# Altium schematic sheet ECEN403_Team_49_Schematic.SchDoc
size A; SheetNumber: 1; SheetTotal: 1; SPICEModelCacheSBMTSTMV: <root> / <DocumentId>SBMTSTMV</DocumentId> / </root>
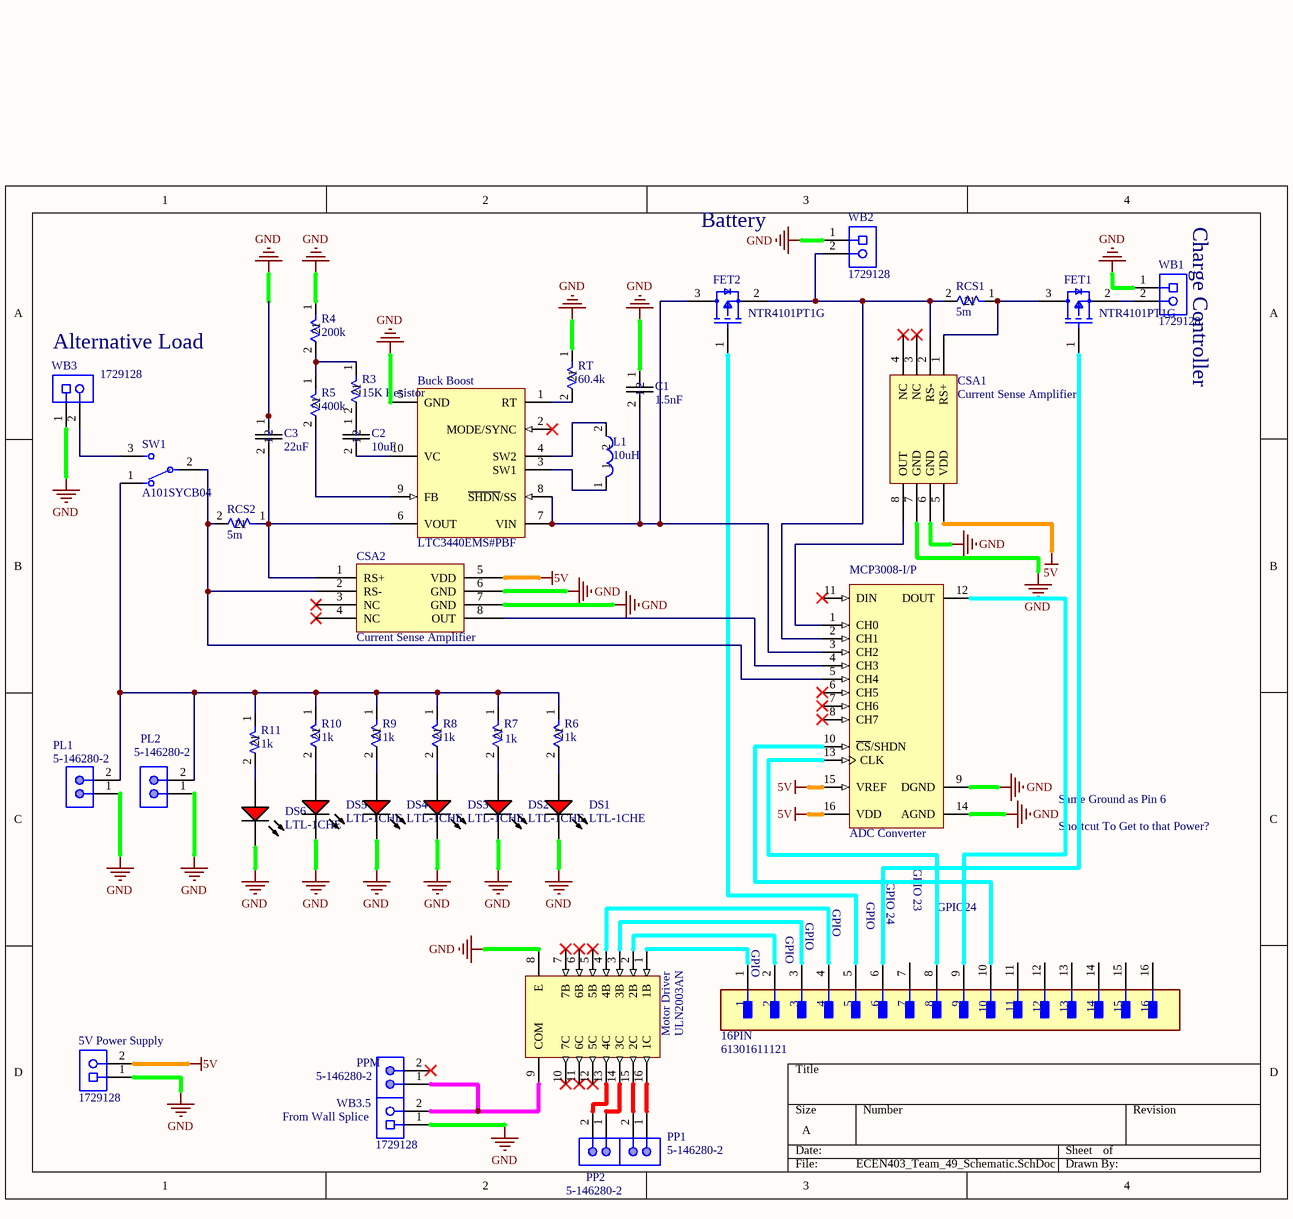
[diagram p0: ECEN403_Team_49_Schematic.SchDoc]

## Parts
5V_Power_Supply  1729128  [Wire To Board]
16PIN  61301611121  [16-FP-61301611121-MFG]
ADC_Converter  MCP3008-I/P  [PDIP300-P16]
Buck_Boost  LTC3440EMS#PBF  [LT-MS-10_M]
C1  1.5nF  [1.5nF Capacitor]
C2  10uF  [10uF Capacitor]
C3  22uF  [22uF Capacitor]
CSA1  Current Sense Amplifier  [Current Sense Amplifier]
CSA2  Current Sense Amplifier  [Current Sense Amplifier]
DS1  LTL-1CHE  [INDPR60-254-520X380X650]
DS2  LTL-1CHE  [INDPR60-254-520X380X650]
DS3  LTL-1CHE  [INDPR60-254-520X380X650]
DS4  LTL-1CHE  [INDPR60-254-520X380X650]
DS5  LTL-1CHE  [INDPR60-254-520X380X650]
DS6  LTL-1CHE  [INDPR60-254-520X380X650]
FET1  NTR4101PT1G  [FP-318-08-MFG]
FET2  NTR4101PT1G  [FP-318-08-MFG]
L1  10uH  [10uH Inductor]
Motor_Driver  ULN2003AN  [N0016A]
PL1  5-146280-2  [TECO-5-146280-2_V]
PL2  5-146280-2  [TECO-5-146280-2_V]
PP1  5-146280-2  [TECO-5-146280-2_V]
PP2  5-146280-2  [TECO-5-146280-2_V]
PPM  5-146280-2  [TECO-5-146280-2_V]
R3  15K Resistor  [15k Resistor]
R4  200k  [200K - duplicate]
R5  400k  [400K Resistor]
R6  1k  [PCBComponent_1]
R7  1k  [PCBComponent_1]
R8  1k  [PCBComponent_1]
R9  1k  [PCBComponent_1]
R10  1k  [PCBComponent_1]
R11  1k  [PCBComponent_1]
RCS1  5m  [Current Sense]
RCS2  5m  [Current Sense]
RT  60.4k  [PCBComponent_1]
SW1  A101SYCB04  [FP-A101SYCB04-MFG]
WB1  1729128  [Wire To Board]
WB2  1729128  [Wire To Board]
WB3  1729128  [Wire To Board]
WB3.5  1729128  [Wire To Board]

## Nets
5V: 5V_Power_Supply.2 ADC_Converter.15(VREF) ADC_Converter.16(VDD) CSA1.5(VDD) CSA2.5(VDD)
GND: 5V_Power_Supply.1 ADC_Converter.9(DGND) ADC_Converter.14(AGND) Buck_Boost.5(GND) C1.1 C3.1 CSA1.6(GND) CSA1.7(GND) CSA2.6(GND) CSA2.7(GND) DS1.2(K) DS2.2(K) DS3.2(K) DS4.2(K) DS5.2(K) DS6.2(K) Motor_Driver.8(E) PL1.1 PL2.1 R4.1 RT.1 WB1.1 WB2.1 WB3.1 WB3.5.1
Net16PIN_1: 16PIN.1 Motor_Driver.1(1B)
Net16PIN_2: 16PIN.2 Motor_Driver.2(2B)
Net16PIN_3: 16PIN.3 Motor_Driver.3(3B)
Net16PIN_4: 16PIN.4 Motor_Driver.4(4B)
Net16PIN_5: 16PIN.5 FET2.1(Gate)
Net16PIN_6: 16PIN.6 FET1.1(Gate)
Net16PIN_8: 16PIN.8 ADC_Converter.13(CLK)
Net16PIN_9: 16PIN.9 ADC_Converter.12(DOUT)
Net16PIN_10: 16PIN.10 ADC_Converter.10(~{CS}/SHDN)
NetADC_Converter_1: ADC_Converter.1(CH0) CSA1.8(OUT)
NetADC_Converter_2: ADC_Converter.2(CH1) CSA1.2(RS-) FET2.2(Source) RCS1.2 WB2.2
NetADC_Converter_3: ADC_Converter.3(CH2) Buck_Boost.7(VIN) Buck_Boost.8(~{SHDN}/SS) C1.2 FET2.3(Drain)
NetADC_Converter_4: ADC_Converter.4(CH3) CSA2.8(OUT)
NetADC_Converter_5: ADC_Converter.5(CH4) CSA2.2(RS-) RCS2.2 SW1.2
NetBuck_Boost_1: Buck_Boost.1(RT) RT.2
NetBuck_Boost_3: Buck_Boost.3(SW1) L1.1
NetBuck_Boost_4: Buck_Boost.4(SW2) L1.2
NetBuck_Boost_6: Buck_Boost.6(VOUT) C3.2 CSA2.1(RS+) RCS2.1
NetBuck_Boost_9: Buck_Boost.9(FB) R5.2
NetBuck_Boost_10: Buck_Boost.10(VC) C2.2
NetC2_1: C2.1 R3.2
NetCSA1_1: CSA1.1(RS+) FET1.3(Drain) RCS1.1
NetDS1_1: DS1.1(A) R6.2
NetDS2_1: DS2.1(A) R7.2
NetDS3_1: DS3.1(A) R8.2
NetDS4_1: DS4.1(A) R9.2
NetDS5_1: DS5.1(A) R10.2
NetDS6_1: DS6.1(A) R11.2
NetFET1_2: FET1.2(Source) WB1.2
NetMotor_Driver_9: Motor_Driver.9(COM) PPM.1 WB3.5.2
NetMotor_Driver_13: Motor_Driver.13(4C) PP2.2
NetMotor_Driver_14: Motor_Driver.14(3C) PP2.1
NetMotor_Driver_15: Motor_Driver.15(2C) PP1.2
NetMotor_Driver_16: Motor_Driver.16(1C) PP1.1
NetPL1_2: PL1.2 PL2.2 R6.1 R7.1 R8.1 R9.1 R10.1 R11.1 SW1.1
NetR3_1: R3.1 R4.2 R5.1
NetSW1_3: SW1.3 WB3.2

Not connected (* = marked no-connect by the designer): 16PIN 7 11 12 13 14 15 16; ADC_Converter 6(CH5)* 7(CH6)* 8(CH7)* 11(DIN)*; Buck_Boost 2(MODE/SYNC)*; CSA1 3(NC)* 4(NC)*; CSA2 3(NC)* 4(NC)*; Motor_Driver 5(5B)* 6(6B)* 7(7B)* 10(7C)* 11(6C)* 12(5C)*; PPM 2*

## Notes on the sheet
- Battery
- (near WB1) Charge Controller
- (near WB3) Alternative Load
- Same Ground as Pin 6
- GPIO 24
- GPIO 23
- Shortcut To Get to that Power?
- (near 16PIN) GPIO
- GPIO
- GPIO24
- From Wall Splice

## Library data of the parts
5V_Power_Supply WB1-WB3 WB3.5 = CMP-2000-05815-1: PCB Terminal Block, 13.5 A, 400 V, 2-Pin THD, RoHS, Bulk; Manufacturer: Phoenix Contact; Package Version: 03/2015; No. of Rows: 1; Pitch: 5.08mm; No. of Positions: 2; Voltage Rating: 400V; Current Rating: 13500mA; Manufacturer URL: http://www.phoenixcontact.com/; Datasheet URL: https://datasheet.ciiva.com/16046/1729128-16046181.pdf; RoHS: TRUE; Package URL: https://www.phoenixcontact.com/online/portal/pi/pxc/product_detail_page/!ut/p/b1/3VdJjqNKFDxLH8AFycySyWY2ozFsEPOMMQaDOX1XedGL_1Vdm5YXJleknhSKeBkvI6EA8ncAo3AYoDhBQGco6KN7VURTdemj9us_IEKEZo_YHiPAEWEFmDGOHMORkqKYCORBZxgL7ZoaZYcbFFUZ3fqxSY6GOuxydWUuHqz1ynmMFygu583Bob0Ewr6Sd_l-5m-kAueHiB0jpRwZwe58wwtkpxtMYd_LmGcDRU02dRNEyWt6Y2ti5pSyJ_reIkzIulrqApdnbT11V5jnCKbYNCvhEM1MCpPByat_X379-iThf08CI5GfOPqfBeS3BRoBOdD55AKVv0iLwCMq-2BrzXWSGRH7pUGD9uwXQjiph3xL0DKQwdGa0JImiIOmBNOestqgwTHSSs2oOep-78apyXQBvNi8ZLaFjvjWvcaUEBu0MC6Wbe-d6mB0FAebo2lUWinqYaZs5DAYzV0RP9yitUjnGJ0iI9xhZkT42OCQNUJJhkgWINNQLP2JFP6OpMg3JCVg70jqHT0lvKOnhHf0lPuOnnLf0VPuWx6_dxwUIvwk5WMkT0kLL1mh61l2yZVSzG3pYV_bqo-mj6uMKwKwdnnW8Jh5RTOJzMOA5c-eJDaZQw4mTMPH02PvS_ZAqNVjVTo2WyYLkwH_KU1mmmG5kjRhDqPXLwwVHvVOjCM60-fpXvTDfMGW1PVFVS1r4e4yVDk4ZdNbkUHvqPqQSeian4UD39fNKmachqdJ1NJbyk8rXT9mXTvPk3oE5meulKGgiruPJek-4I9hTT6G8ZLOyRSm2RRVbThERQad5OS28hdt4YW4vG0stgYYzsWsK4_7y6DZMjJSCqri1kyiZR5vD7pwIrNR7QwPHTcLTI5qT7eRlpHrdGiupYlqQDJ7zy_CND8fWWBoLRXxk1RVcXiBQwbTD4Xi7KL-FuO94t9xaqweXzH; PartNumber: 1729128; Package Description: 2-Pin Through Hole Device, Body 8.1 x 10.16 mm, Pitch 5.08 mm; Datasheet Version: 12/2013; Mounting Technology: ThroughHole; Orientation: Horizontal; Package Reference: 1729128-2; Packing: Bulk
16PIN = CMP-1502-01095-2: CONN HEADER VERT 16POS 2.54MM; Pitch: 0.1inch; Voltage Rating: 250V; Number of Contacts: 16; Gender: Male; Flammability Rating: UL94 V-0; Fastening Type: Pull; Contact Plating: Gold; Termination: Solder; Contact Type: Male Pin; Number of Rows: 1; Max Operating Temperature: 105°C; Insulation Color: Black; Min Operating Temperature: -40°C; Mount: Through Hole; Contact Mating Length: 0.236inch; Contact Finish - Mating: GOLD; Insulation Material: Nylon; Color: Black; Packaging: Bulk; Number of Positions: 16; RoHS Compliant: Yes; Series: WR-PHD; Connector Type: Header; Contact Material: Copper Alloy; Contact Shape: Square
ADC_Converter = CMP-0188-00184-2: 2.7V 4-Channel/8-Channel 10-Bit A/D Converters with SPI Serial Interface, 16-Pin PDIP, Industrial Temperature; ComponentLink1URL: http://www.microchip.com/; ComponentLink2URL: http://ww1.microchip.com/downloads/en/DeviceDoc/21295d.pdf; PackageVersion: revBB, Aug-2009; ComponentLink3URL: http://www.microchip.com/stellent/groups/techpub_sg/documents/packagingspec/en012702.pdf; DatasheetVersion: revD, Dec-2008; PackageDescription: 16-Lead Plastic Dual In-Line (P) - 300 mil Body [PDIP]; ComponentLink3Description: Package Specification; Code_JEDEC: MS-001-BB; ComponentLink1Description: Manufacturer URL; RevisionNote: URLs added.; PackageReference: PDIP300-P16; ComponentLink2Description: Datasheet
Buck_Boost = CMP-0492-01290-1: Micropower Synchronous Buck-Boost DC/DC Converter, 10-pin SOP (MS-10), -40 to 85 degC, Pb-Free; Manufacturer: Linear Technology; Frequency Sync Range: 300kHz - 2MHz; Number of Outputs: 1; DatasheetVersion: Rev. B; PackageVersion: Rev. E, 06/2010; ComponentLink2Description: Datasheet; ComponentLink1URL: http://www.linear.com/; ComponentLink3URL: http://cds.linear.com/docs/en/packaging/05081661_F_MS.pdf; PackageDescription: 10-Pin Plastic MSOP, Body 3 x 3 mm, Pitch 0.5 mm; ComponentLink1Description: Manufacturer URL; Mounting Technology: Surface Mount; RoHS: TRUE; ComponentLink3Description: Package Specification; ComponentLink2URL: http://cds.linear.com/docs/en/datasheet/3440fb.pdf; PartNumber: LTC3440EMS#PBF; PackageReference: MS-10
C2 = 10uF Capacitor
C3 = 22uF Capacitor
DS1-DS6 = CMP-1674-00005-1: Radial LED, 12.6 mcd, 20 mA, 2 V, -55 to 100 degC, 2-Pin THD, RoHS, Bulk; Shielding: Unshielded; Resistance: 0.045 Ohm; Current Rating: 3.6 A; Tolerance: 20%; PackageReference: LTL-1CHE; PackageDescription: 2-Pin Through Hole Device, Dia 3.8 mm, Pitch 2.54 mm; Case\Package: Radial; Length: 0.97 inch; Width: 0.62 inch; Height: 1.1 inch; Radiation Hardening: No; Lead Pitch: 11.44 mm; ComponentLink1URL: http://www.us.liteon.com/; ComponentLink1Description: Manufacturer URL; RoHSCompliant: true; Packaging: Tray; Mount: Through Hole; Min Operating Temperature: -40 degC; Max Operating Temperature: 130 degC; ComponentLink2URL: https://datasheet.ciiva.com/15117/getdatasheetpartid-187746-15117985.pdf; Package Quantity: 55; ComponentLink2Description: Datasheet; DatasheetVersion: Dec-03
FET1 FET2 = CMP-1058-00754-2: MOSFET P-CH 20V 1.8A SOT-23; Threshold Voltage: -720mV; Rise Time: 12.6ns; Turn-Off Delay Time: 30.2ns; Voltage Rating (DC): -20V; Input Capacitance: 675pF; Power Dissipation: 730mW; Current Rating: -3.2A; Turn-On Delay Time: 7.5ns; Gate to Source Voltage (Vgs): 8V; Element Configuration: Single; Number of Elements: 1; On-State Resistance: 70MR; Rds On Max: 85mR; Drain to Source Resistance: 112mR; Height: 0.94mm; Min Operating Temperature: -55°C; Lead Free: Lead Free; Fall Time: 12.6ns; Nominal Vgs: -720mV; REACH SVHC: No SVHC; Number of Pins: 3; Contact Plating: Tin; Case/Package: SOT-23-3; Radiation Hardening: No; Length: 2.9mm; Width: 1.3mm; Package Quantity: 1; Max Operating Temperature: 150°C; Drain to Source Breakdown Voltage: -20V; Max Power Dissipation: 730mW; Packaging: Tape and Reel; Drain to Source Voltage (Vdss): 20V; Continuous Drain Current (ID): -3.2A
L1 = 10uH Inductor
Motor_Driver = CMP-2000-07352-1: High-Voltage, High-Current Darlington Transistor Array, 50 V, 500 mA, -20 to 70 degC, 16-Pin PDIP (N), Pb-Free (RoHS), Tube; Manufacturer: TexasInstruments; Maximum Collector Emitter Saturation Voltage: 1.1@100mA|1.3@200mA|1.6@350mAV; Peak DC Collector Current: 0.5A; Package Version: 4040049/E, 12/2002; Configuration: Array7; Maximum Collector Emitter Voltage: 50V; Rad Hard: No; Mounting: ThroughHole; Datasheet URL: http://www.ti.com/general/docs/lit/getliterature.tsp?genericPartNumber=uln2003a&fileType=pdf; Package: 16PDIP; Package Reference: N16; Datasheet Version: Rev. O, 01/2016; Mounting Technology: ThroughHole; Package Description: 16-Pin Plastic In-Line, Body 19.305 x 6.35 mm, Pitch 2.54 mm; Manufacturer URL: http://www.ti.com/; Type: NPN; Category: DarlingtonBJT; Package URL: http://www.ti.com/litv/pdf/mpdi002c; Packaging: Rail/Tube
PL1 PL2 PP1 PP2 PPM = CMP-2000-07492-1: Male Header, Pitch 2.54 mm, 1 x 2 Position, Height 8.21 mm, Tail Length 3.05 mm, -65 to 105 degC, RoHS, Bulk; Manufacturer: TE Connectivity; Mating Connector Lock: No(Without); Number of Positions: 2; Pitch: 2.54mm; PCB Mounting Orientation: Vertical; Keyed: No; Case\/Package: 100; Mating Post Length: 0.23inch; High Temperature Housing: Yes; Max Current Rating: 5A; PCB Thickness: 0.063inch; PCB Mount Retention: Without; Approvals: CSA; Current Rating: 3A; Radiation Hardening: No; Length: 4.67mm; Contact Mating Length: 0.23inch; Connector Type: Header; Number of Rows: 1; Termination Post Length: 0.12inch; Board Standoff: No(Without); Max Operating Temperature: 105degC; Contact Shape: Square; Selectively Loaded: No(Without); Gasket: No(Without); Number of Contacts: 2; Contact Gender: Male; Mating Alignment: No(Without); Manufacturer URL: http://www.te.com/; Datasheet URL: http://www.te.com/commerce/DocumentDelivery/DDEController?Action=showdoc&DocId=Customer+Drawing%7F146280%7FH1%7Fpdf%7FEnglish%7FENG_CD_146280_H1.pdf%7F5-146280-2; Mount: ThroughHole; Orientation: Straight; Packaging: Carton; Package Reference: 5-146280-2; Package Quantity: 500; Stabilizers: No(Without); Row Spacing: 2.54mm; Contact Material: CopperAlloy; Panel Mount Retention: No(Without); Datasheet Version: Rev. H1, 08/2016; Housing Colour: Black; Colour: Black; Package Description: Male Header, Pitch 2.54 mm, 1 x 2 Position, Height 8.21 mm, Tail Length 3.05 mm; Contact Plating: Matte; Housing Material: Polymer; Contact Protection: No(Without); Min Operating Temperature: -65degC; Mounting Technology: ThroughHole; Flammability Rating: UL94V-0; RoHSCompliant: true; Termination: ThroughHole; Depth: 2.34mm; High Speed Serial Data Connector: No
R4 = 200k Resistor
R5 = 400k Resistor
R6-R11 = 1k Resistor
RCS1 RCS2 = Current Sense Resistor
RT = 60.4k Resistor
SW1 = CMP-03408-000017-1: SWITCH TOGGLE SPDT 0.4VA 20V; Electrical Life: 6000Cycles; Number of Poles: 1; Power Rating: 400mW; Switch Function: On-On; Contact Resistance: 10mR; Contact Current Rating: 400mA; Actuator Material: Phenolic; Insulation Resistance: 30MR; Actuator Color: Chrome; Number of Positions: 2; Actuator Type: Standard Round; Actuator Length: 10.41mm; Illumination Type: Non-Illuminated; Flammability Rating: UL94 V-1; Contact Material: Copper; Depth: 6.86mm; Contact Plating: Gold; Voltage Rating (AC): 20V; Max Voltage Rating (DC): 20V; Min Operating Temperature: -30°C; Max Operating Temperature: 85°C; Throw Configuration: SPDT; Packaging: Bulk; Termination: PC Pins; Series: Gemini A; ELV: Compliant; Lead Free: Lead Free; RoHS Compliant: Yes; REACH SVHC: No SVHC; Mount: Panel; Orientation: Straight; Package Quantity: 100; Max Voltage Rating (AC): 20V; Radiation Hardening: No; Voltage Rating (DC): 20V